# Altium schematic sheet PowerBoard.SchDoc
size A3
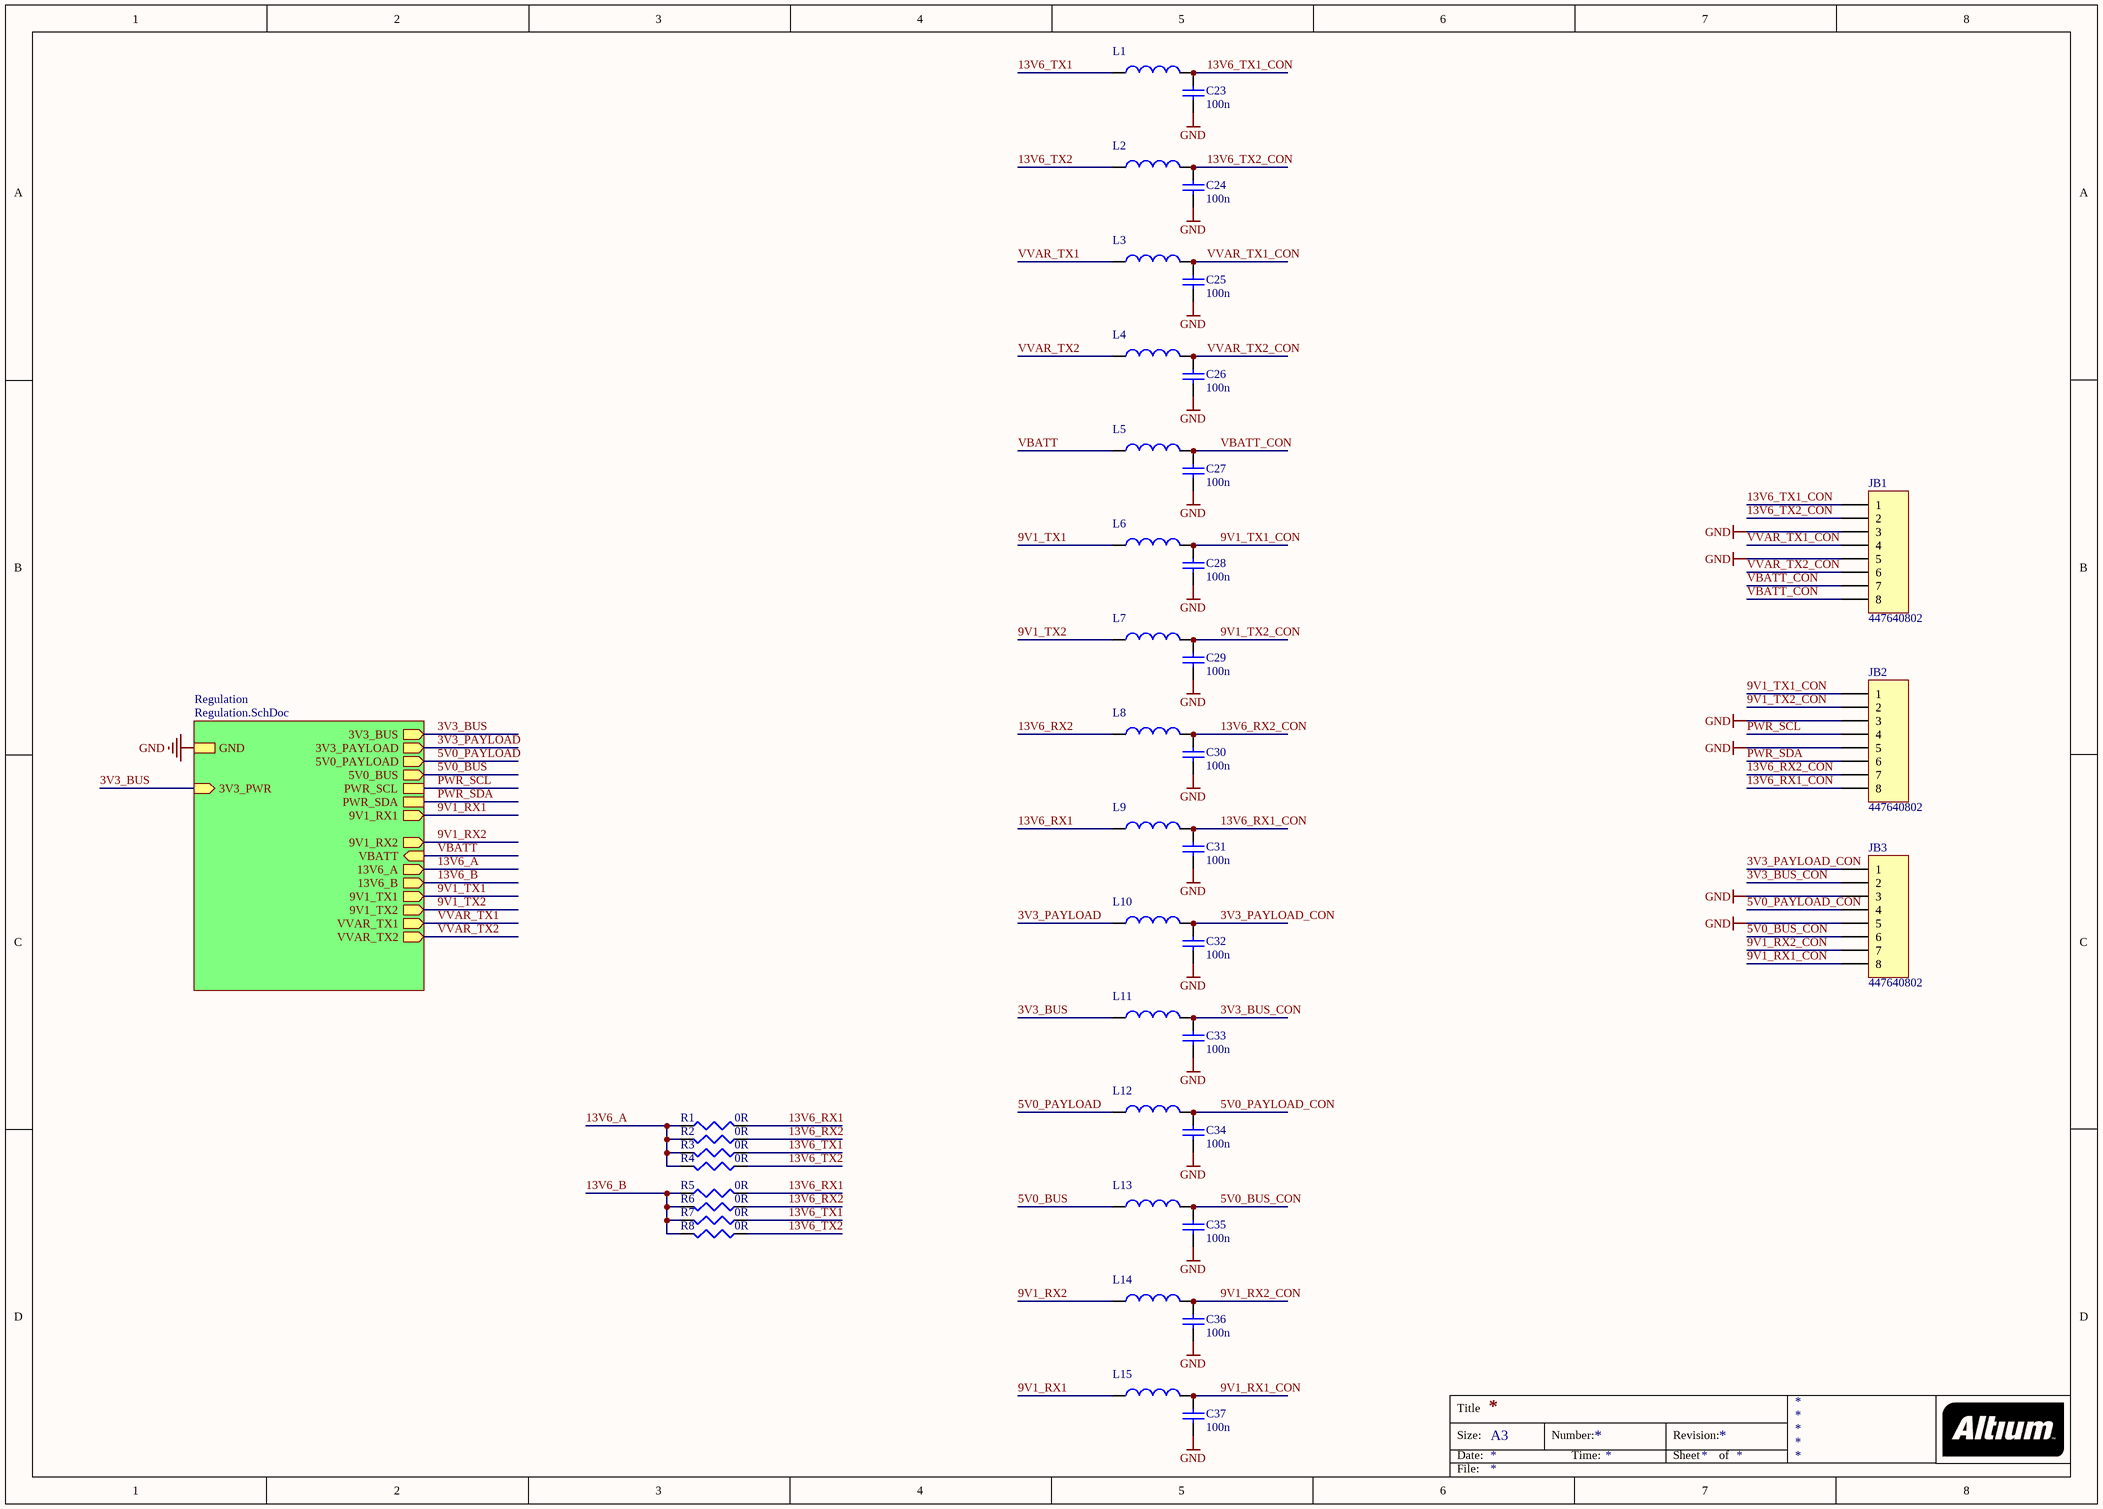
[diagram p0: PowerBoard.SchDoc]

## Parts
C23  value 100n  [R0805M]
C24  value 100n  [R0805M]
C25  value 100n  [R0805M]
C26  value 100n  [R0805M]
C27  value 100n  [R0805M]
C28  value 100n  [R0805M]
C29  value 100n  [R0805M]
C30  value 100n  [R0805M]
C31  value 100n  [R0805M]
C32  value 100n  [R0805M]
C33  value 100n  [R0805M]
C34  value 100n  [R0805M]
C35  value 100n  [R0805M]
C36  value 100n  [R0805M]
C37  value 100n  [R0805M]
JB1  447640802  [MOLEX 447640802]
JB2  447640802  [MOLEX 447640802]
JB3  447640802  [MOLEX 447640802]
L1  BLM31PG121SN1L  [INDC3216M]  (value not drawn)
L2  BLM31PG121SN1L  [INDC3216M]  (value not drawn)
L3  BLM31PG121SN1L  [INDC3216M]  (value not drawn)
L4  BLM31PG121SN1L  [INDC3216M]  (value not drawn)
L5  BLM31PG121SN1L  [INDC3216M]  (value not drawn)
L6  BLM31PG121SN1L  [INDC3216M]  (value not drawn)
L7  BLM31PG121SN1L  [INDC3216M]  (value not drawn)
L8  BLM31PG121SN1L  [INDC3216M]  (value not drawn)
L9  BLM31PG121SN1L  [INDC3216M]  (value not drawn)
L10  BLM31PG121SN1L  [INDC3216M]  (value not drawn)
L11  BLM31PG121SN1L  [INDC3216M]  (value not drawn)
L12  BLM31PG121SN1L  [INDC3216M]  (value not drawn)
L13  BLM31PG121SN1L  [INDC3216M]  (value not drawn)
L14  BLM31PG121SN1L  [INDC3216M]  (value not drawn)
L15  BLM31PG121SN1L  [INDC3216M]  (value not drawn)
R1  value 0R  [R0402M]
R2  value 0R  [R0402M]
R3  value 0R  [R0402M]
R4  value 0R  [R0402M]
R5  value 0R  [R0402M]
R6  value 0R  [R0402M]
R7  value 0R  [R0402M]
R8  value 0R  [R0402M]

## Sub-sheets
Regulation = Regulation.SchDoc: 5V0_BUS (out), 3V3_BUS (out), 5V0_PAYLOAD (out), 3V3_PAYLOAD (out), 9V1_RX1 (out), 9V1_RX2 (out), VBATT (in), GND, 3V3_PWR (in), VVAR_TX1 (out), 13V6_A (out), 9V1_TX1 (out), VVAR_TX2 (out), 13V6_B (out), 9V1_TX2 (out), PWR_SCL, PWR_SDA

## Nets
GND: C23.2 C24.2 C25.2 C26.2 C27.2 C28.2 C29.2 C30.2 C31.2 C32.2 C33.2 C34.2 C35.2 C36.2 C37.2 JB1.3 JB1.5 JB2.3 JB2.5 JB3.3 JB3.5 ; sheet Regulation/GND
3V3_BUS: L11.1 ; sheet Regulation/3V3_BUS, sheet Regulation/3V3_PWR
3V3_BUS_CON: C33.1 JB3.2 L11.2
3V3_PAYLOAD: L10.1 ; sheet Regulation/3V3_PAYLOAD
3V3_PAYLOAD_CON: C32.1 JB3.1 L10.2
5V0_BUS: L13.1 ; sheet Regulation/5V0_BUS
5V0_BUS_CON: C35.1 JB3.6 L13.2
5V0_PAYLOAD: L12.1 ; sheet Regulation/5V0_PAYLOAD
5V0_PAYLOAD_CON: C34.1 JB3.4 L12.2
9V1_RX1: L15.1 ; sheet Regulation/9V1_RX1
9V1_RX1_CON: C37.1 JB3.8 L15.2
9V1_RX2: L14.1 ; sheet Regulation/9V1_RX2
9V1_RX2_CON: C36.1 JB3.7 L14.2
9V1_TX1: L6.1 ; sheet Regulation/9V1_TX1
9V1_TX1_CON: C28.1 JB2.1 L6.2
9V1_TX2: L7.1 ; sheet Regulation/9V1_TX2
9V1_TX2_CON: C29.1 JB2.2 L7.2
13V6_A: R1.1 R2.2 R3.2 R4.2 ; sheet Regulation/13V6_A
13V6_B: R5.1 R6.2 R7.2 R8.2 ; sheet Regulation/13V6_B
13V6_RX1: L9.1 R1.2 R5.2
13V6_RX1_CON: C31.1 JB2.8 L9.2
13V6_RX2: L8.1 R2.1 R6.1
13V6_RX2_CON: C30.1 JB2.7 L8.2
13V6_TX1: L1.1 R3.1 R7.1
13V6_TX1_CON: C23.1 JB1.1 L1.2
13V6_TX2: L2.1 R4.1 R8.1
13V6_TX2_CON: C24.1 JB1.2 L2.2
PWR_SCL: JB2.4 ; sheet Regulation/PWR_SCL
PWR_SDA: JB2.6 ; sheet Regulation/PWR_SDA
VBATT: L5.1 ; sheet Regulation/VBATT
VBATT_CON: C27.1 JB1.7 JB1.8 L5.2
VVAR_TX1: L3.1 ; sheet Regulation/VVAR_TX1
VVAR_TX1_CON: C25.1 JB1.4 L3.2
VVAR_TX2: L4.1 ; sheet Regulation/VVAR_TX2
VVAR_TX2_CON: C26.1 JB1.6 L4.2

## Notes on the sheet
- Title
- Size:
- Date:
- A3
- Number:
- Time:
- Revision:
- Sheet
- of
- File:

## Library data of the parts
C23-C37 = Cap: Capacitor; Published: 8-Jun-2000; LatestRevisionDate: 17-Jul-2002; LatestRevisionNote: Re-released for DXP Platform.; PackageReference: RAD-0.3; Publisher: Altium Limited; PackageDescription: Radial Cap, Thru-Hole; 2 Leads; 0.3 in Pin Spacing
JB1-JB3 = MOLEX 447640802: B2B RA Receptacle
L1-L15 = Inductor: Ferrite Bead; Code_IEC: 3216M; Value: 120R@100MHz; Published: 8-Jun-2000; LatestRevisionDate: 29-May-2009; LatestRevisionNote: IPC-7351 Footprint Added.; PackageReference: 3216; Publisher: Altium Limited; PackageDescription: Ferrite Bead; Code_JEITA: 1206M
R1-R8 = Res3: Resistor; Published: 8-Jun-2000; LatestRevisionDate: 29-May-2009; LatestRevisionNote: IPC-7351 Footprint Added.; PackageReference: J1-0603; Publisher: Altium Limited; PackageDescription: Chip Resistor